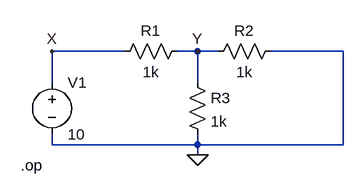
[diagram p0: schematic 1a.asc]
1a.asc, the LTspice schematic file:
Version 4
SHEET 1 880 680
WIRE 32 16 -80 16
WIRE 144 16 112 16
WIRE 176 16 144 16
WIRE 368 16 256 16
WIRE -80 64 -80 16
WIRE 144 64 144 16
WIRE -80 160 -80 144
WIRE 144 160 144 144
WIRE 144 160 -80 160
WIRE 368 160 368 16
WIRE 368 160 144 160
WIRE 144 176 144 160
FLAG 144 176 0
FLAG -80 16 X
FLAG 144 16 Y
SYMBOL res 128 0 R90
WINDOW 0 0 56 VBottom 2
WINDOW 3 32 56 VTop 2
SYMATTR InstName R1
SYMATTR Value 1k
SYMBOL res 272 0 R90
WINDOW 0 0 56 VBottom 2
WINDOW 3 32 56 VTop 2
SYMATTR InstName R2
SYMATTR Value 1k
SYMBOL res 128 48 R0
SYMATTR InstName R3
SYMATTR Value 1k
SYMBOL voltage -80 48 R0
SYMATTR InstName V1
SYMATTR Value 10
TEXT -128 192 Left 2 !.op

The netlist it stands for:
* 1a.asc
R1 Y X 1k
R2 0 Y 1k
R3 Y 0 1k
V1 X 0 10
.op
.backanno
.end